# EAGLE design led driver (EAGLE 9.6.2)
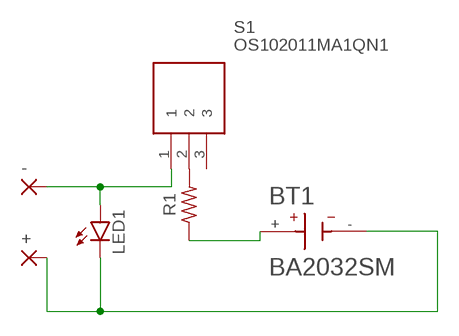
[diagram p0: schematic, sheet 1]

## Parts
+  2,54/1,1  [2,54/1,1]
-  2,54/1,1  [2,54/1,1]
BT1  BA2032SM  [BAT_BA2032SM]
LED1  LED5MM  [LED5MM]
R1  R-US_AXIAL-11.7MM-PITCH  [RESAD1176W63L850D250B]
S1  OS102011MA1QN1  [OS102011MA1QN1]

## Nets
N$1: R1.2 S1.2
N$2: -.1(P) LED1.A S1.1
N$3: +.1(P) BT1.- LED1.K(C)
N$4: BT1.+ R1.1
Unconnected: S1.3

## Library data of the parts
+ - = wirepad:2,54/1,1: THROUGH-HOLE PAD
BT1 = BA2032SM:BA2032SM: BATTERY HOLDER COIN 20MM SMD; DESCRIPTION: BATTERY HOLDER COIN 20MM SMD; DIGI-KEY_PART_NUMBER: BA2032SM-ND; MF: MPD; MP: BA2032SM; PACKAGE: None; PURCHASE-URL: https://pricing.snapeda.com/search/part/BA2032SM/?ref=eda
LED1 = led:LED: LED OSRAM: - CHIPLED LG R971, LG N971, LY N971, LG Q971, LY Q971, LO R971, LY R971 LH N974, LH R974 LS Q976, LO Q976, LY Q976 LO Q996 - Hyper CHIPLED LW Q18S LB Q993, LB Q99A, LB R99A - SideLED LS A670, LO A670, LY A670, LG A670, LP A670 LB A673, LV A673, LT A673, LW A673 LH A674 LY A675 LS A676, LA A676, LO A676, LY A676, LW A676 LS A679, LY A679, LG A679 - Hyper Micro SIDELED® LS Y876, LA Y876, LO Y876, LY Y876 LT Y87S - SmartLED LW L88C, LW L88S LB L89C, LB L89S, LG L890 LS L89K, LO L89K, LY L89K LS L896, LA L896, LO L896, LY L896 - TOPLED LS T670, LO T670, LY T670, LG T670, LP T670 LSG T670, LSP T670, LSY T670, LOP T670, LYG T670 LG T671, LOG T671, LSG T671 LB T673, LV T673, LT T673, LW T673 LH T674 LS T676, LA T676, LO T676, LY T676, LB T676, LH T676, LSB T676, LW T676 LB T67C, LV T67C, LT T67C, LS T67K, LO T67K, LY T67K, LW E67C LS E67B, LA E67B, LO E67B, LY E67B, LB E67C, LV E67C, LT E67C LW T67C LS T679, LY T679, LG T679 LS T770, LO T770, LY T770, LG T770, LP T770 LB T773, LV T773, LT T773, LW T773 LH T774 LS E675, LA E675, LY E675, LS T675 LS T776, LA T776, LO T776, LY T776, LB T776 LHGB T686 LT T68C, LB T68C - Hyper Mini TOPLED® LB M676 - Mini TOPLED Santana® LG M470 LS M47K, LO M47K, LY M47K Source: http://www.osram.convergy.de LUXEON: - LUMILED® LXK2-PW12-R00, LXK2-PW12-S00, LXK2-PW14-U00, LXK2-PW14-V00 LXK2-PM12-R00, LXK2-PM12-S00, LXK2-PM14-U00 LXK2-PE12-Q00, LXK2-PE12-R00, LXK2-PE12-S00, LXK2-PE14-T00, LXK2-PE14-U00 LXK2-PB12-K00, LXK2-PB12-L00, LXK2-PB12-M00, LXK2-PB14-N00, LXK2-PB14-P00, LXK2-PB14-Q00 LXK2-PR12-L00, LXK2-PR12-M00, LXK2-PR14-Q00, LXK2-PR14-R00 LXK2-PD12-Q00, LXK2-PD12-R00, LXK2-PD12-S00 LXK2-PH12-R00, LXK2-PH12-S00 LXK2-PL12-P00, LXK2-PL12-Q00, LXK2-PL12-R00 Source: www.luxeon.com KINGBRIGHT: KA-3528ASYC Source: www.kingbright.com
R1 = Resistor:R-US: Resistor Fixed - ANSI; CATEGORY: Resistor; SUB-CATEGORY: Fixed
S1 = OS102011MA1QN1:OS102011MA1QN1: Switch Slide Right Angle SPDT 0.1A 12VDC Through Hole Slide Switch SPDT On-On 0.1 A@ 12 V dc Slide Source: Datasheet <http://www.ckswitches.com/media/1428/os.pdf>; DESCRIPTION: Switch Slide Right Angle SPDT 0.1A 12VDC Through Hole Slide Switch SPDT On-On 0.1 A@ 12 V dc Slide; HEIGHT: mm; MANUFACTURER_NAME: C & K COMPONENTS; MANUFACTURER_PART_NUMBER: OS102011MA1QN1; MOUSER_PART_NUMBER: 611-OS102011MA1QN1; MOUSER_PRICE-STOCK: https://www.mouser.co.uk/ProductDetail/CK/OS102011MA1QN1?qs=WtljUlYws5R6MUgHcLkz4w%3D%3D

## Board
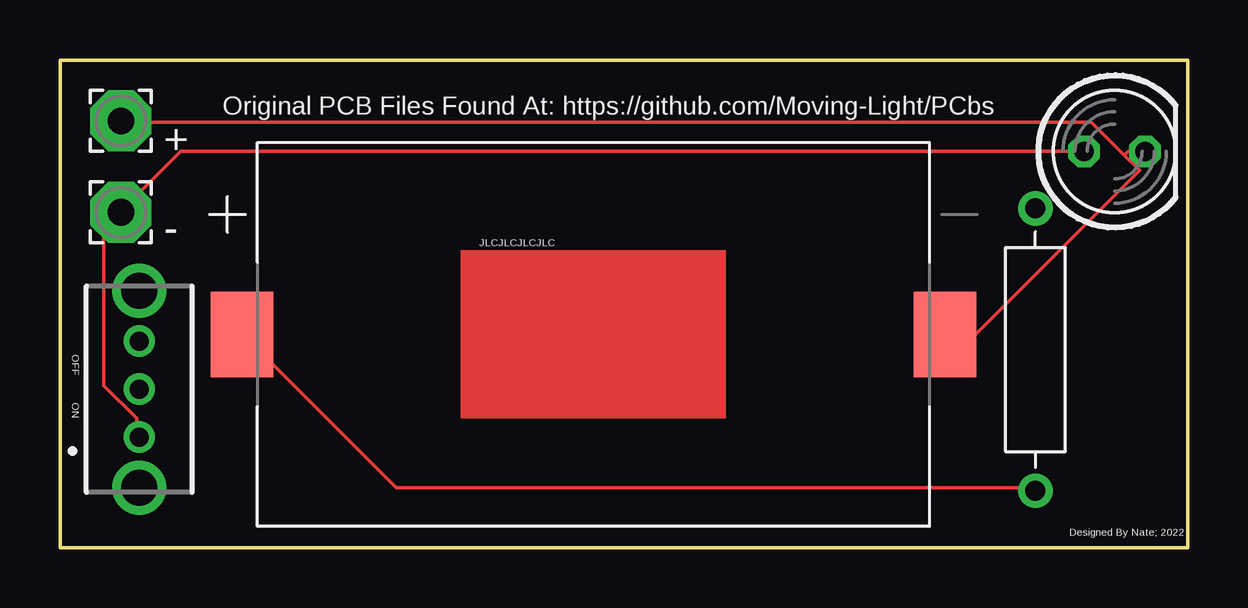
[diagram p1: board, top side]
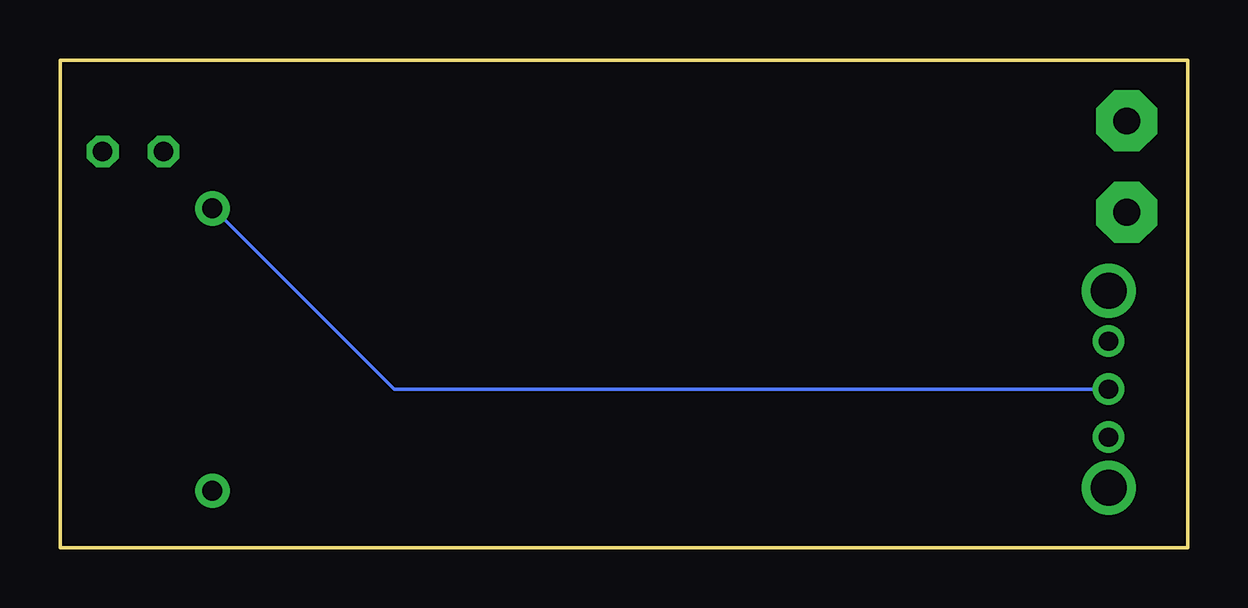
[diagram p2: board, bottom side, seen from below]

Size 46.99 x 20.32 mm. Coordinates in mm from the lower left corner, seen from the top.
Outline: 0,0 46.99,0 46.99,20.32 0,20.32 0,0
Copper layers (1*16): Top 0.035mm / dielectric 1.5mm / Bottom 0.035mm
Design rules "default": minimum track width 6mil, minimum drill 0.35mm, track to track 6mil, track to pad 6mil, pad to pad 6mil, via to via 6mil, smd to smd 6mil, copper to edge 40mil, drill to drill 6mil, minimum pad ring 10mil, minimum via ring 8mil, stop-mask expansion 4mil, vias tented up to drill 0mil, thermal gap 10mil

### Footprints (pad centres in the part's own frame; a part is rotated, then mirrored left to right if it is on the bottom)
2,54/1,1 = drill 1.118 pad 2.54 octagon: 1 0,0
BAT_BA2032SM = smd 2.6 x 3.56: + -14.65,0; - 14.65,0
LED5MM = drill 0.813 octagon: A -1.27,0; K 1.27,0
RESAD1176W63L850D250B = drill 0.83 pad 1.43: 1 -5.88,0; 2 5.88,0
OS102011MA1QN1 = drill 0.8 pad 1.3: 1 -2,0; 2 0,0; 3 2,0 | drill 1.5 pad 2.25: 4 -4.1,0; 5 4.1,0

### Placement (x,y rotation side)
+  2.54,17.78 0 top
-  2.54,13.97 0 top
BT1  22.23,8.89 0 top
LED1  43.94,16.51 0 top
R1  40.64,8.26 90 top
S1  3.3,6.6 90 top

### Tracks (layer width: path | path; a pad name or v marks a point on that pad's centre or on a via)
N$1
  Bottom 0.152: S1.2 33.07,6.6 40.54,14.07 R1.2
N$2
  Top 0.152: S1.1 3.2,4.62 3.2,5.38 1.83,6.76 1.83,13.31 2.44,13.92 -.1 2.59,14.07 5.03,16.51 LED1.A
N$3
  Top 0.152: LED1.K 44.5,16.51 44.35,16.36 | BT1.- 38.15,8.89 44.98,15.72 44.35,16.36 | 44.35,16.36 42.98,17.73 2.59,17.73 +.1
N$4
  Top 0.152: R1.1 40.54,2.49 14.02,2.49 7.62,8.89 BT1.+

### Text on the board
tNames: Original PCB Files Found At: https://github.com/Moving-Light/PCbs | JLCJLCJLCJLC | OFF | ON | Designed By Nate; 2022